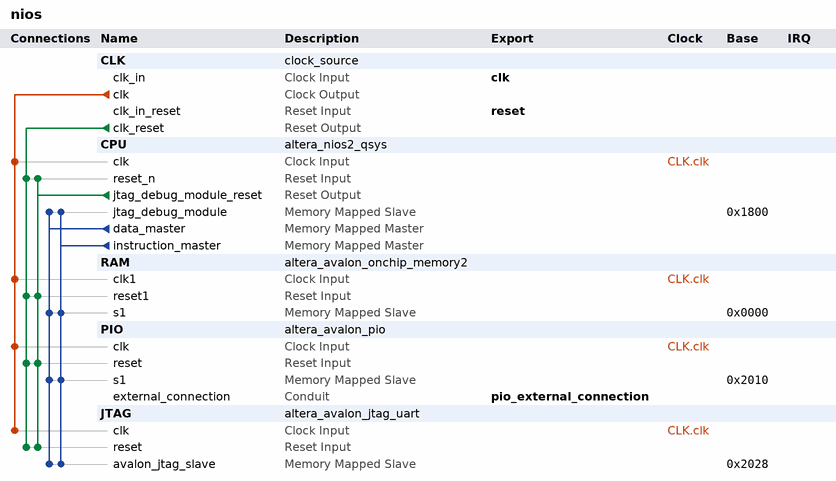
[diagram p0: system contents]
# Platform Designer (Qsys) system nios, Cyclone IV E EP4CE6E22C8
# Parameters at their usual value, and those the tool derives, are not listed.
package require -exact qsys 13.0.1
create_system nios
set_project_property DEVICE_FAMILY {Cyclone IV E}
set_project_property DEVICE EP4CE6E22C8

add_instance CLK clock_source 13.0
set_instance_parameter_value CLK clockFrequency 100000000

add_instance CPU altera_nios2_qsys 13.0
set_instance_parameter_value CPU resetSlave RAM.s1
set_instance_parameter_value CPU mmu_TLBMissExcSlave None
set_instance_parameter_value CPU exceptionSlave RAM.s1
set_instance_parameter_value CPU breakSlave CPU.jtag_debug_module
set_instance_parameter_value CPU impl Tiny
set_instance_parameter_value CPU icache_size 4096

add_instance RAM altera_avalon_onchip_memory2 13.0.1
set_instance_parameter_value RAM dataWidth 32
set_instance_parameter_value RAM dualPort false
set_instance_parameter_value RAM initMemContent true
set_instance_parameter_value RAM initializationFileName onchip_mem.hex
set_instance_parameter_value RAM memorySize 4096

add_instance PIO altera_avalon_pio 13.0.1
set_instance_parameter_value PIO direction Output
set_instance_parameter_value PIO resetValue 255
set_instance_parameter_value PIO width 8

add_instance JTAG altera_avalon_jtag_uart 13.0.1
set_instance_parameter_value JTAG simInteractiveOptions NO_INTERACTIVE_WINDOWS

# connections
add_connection CLK.clk CPU.clk clock
add_connection CLK.clk JTAG.clk clock
add_connection CLK.clk PIO.clk clock
add_connection CLK.clk RAM.clk1 clock
add_connection CLK.clk_reset CPU.reset_n reset
add_connection CLK.clk_reset JTAG.reset reset
add_connection CLK.clk_reset PIO.reset reset
add_connection CLK.clk_reset RAM.reset1 reset
add_connection CPU.jtag_debug_module_reset CPU.reset_n reset
add_connection CPU.jtag_debug_module_reset JTAG.reset reset
add_connection CPU.jtag_debug_module_reset PIO.reset reset
add_connection CPU.jtag_debug_module_reset RAM.reset1 reset
add_connection CPU.data_master CPU.jtag_debug_module avalon
set_connection_parameter_value CPU.data_master/CPU.jtag_debug_module baseAddress 0x1800
add_connection CPU.data_master JTAG.avalon_jtag_slave avalon
set_connection_parameter_value CPU.data_master/JTAG.avalon_jtag_slave baseAddress 0x2028
add_connection CPU.data_master PIO.s1 avalon
set_connection_parameter_value CPU.data_master/PIO.s1 baseAddress 0x2010
add_connection CPU.data_master RAM.s1 avalon
set_connection_parameter_value CPU.data_master/RAM.s1 baseAddress 0x0000
add_connection CPU.instruction_master CPU.jtag_debug_module avalon
set_connection_parameter_value CPU.instruction_master/CPU.jtag_debug_module baseAddress 0x1800
add_connection CPU.instruction_master JTAG.avalon_jtag_slave avalon
set_connection_parameter_value CPU.instruction_master/JTAG.avalon_jtag_slave baseAddress 0x2028
add_connection CPU.instruction_master PIO.s1 avalon
set_connection_parameter_value CPU.instruction_master/PIO.s1 baseAddress 0x2010
add_connection CPU.instruction_master RAM.s1 avalon
set_connection_parameter_value CPU.instruction_master/RAM.s1 baseAddress 0x0000

# exported interfaces
add_interface clk clock sink
set_interface_property clk EXPORT_OF CLK.clk_in
add_interface reset reset sink
set_interface_property reset EXPORT_OF CLK.clk_in_reset
add_interface pio_external_connection conduit end
set_interface_property pio_external_connection EXPORT_OF PIO.external_connection

set_interconnect_requirement {$system} qsys_mm.clockCrossingAdapter HANDSHAKE
set_interconnect_requirement {$system} qsys_mm.maxAdditionalLatency 1

save_system nios.qsys
